# EAGLE schematic wiring (EAGLE 7.3.0)
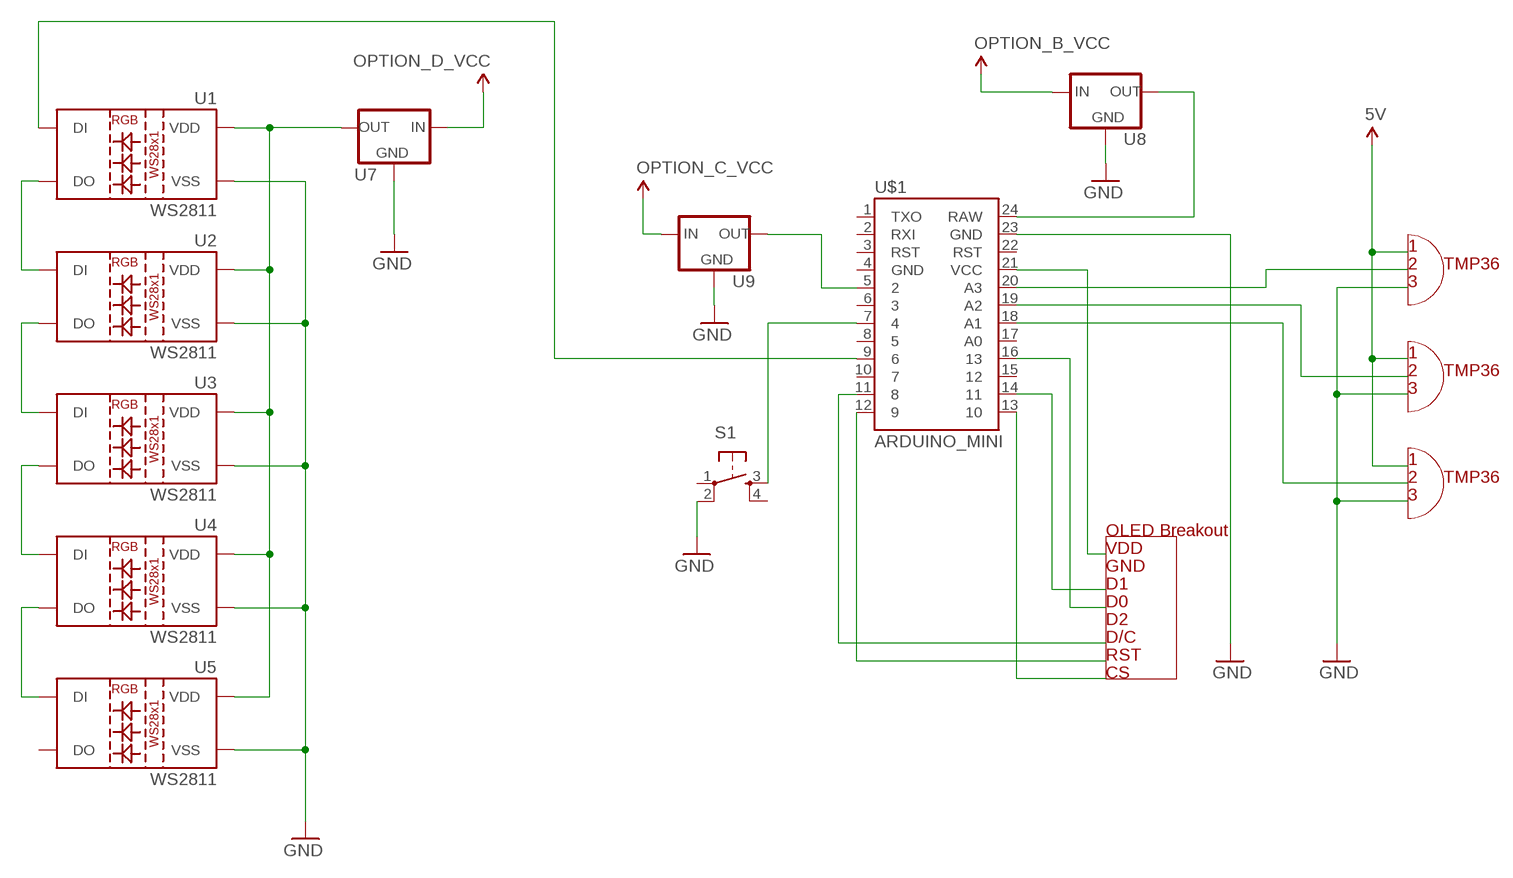
[diagram p0: schematic, sheet 1]

## Parts
S1  TAC_SWITCHPTH  [TACTILE-PTH]
U1  WS2811  LED-TRICOLOR-5050-ICWS2811  [LED-TRICOLOR-5050-IC]
U2  WS2811  LED-TRICOLOR-5050-ICWS2811  [LED-TRICOLOR-5050-IC]
U3  WS2811  LED-TRICOLOR-5050-ICWS2811  [LED-TRICOLOR-5050-IC]
U4  WS2811  LED-TRICOLOR-5050-ICWS2811  [LED-TRICOLOR-5050-IC]
U5  WS2811  LED-TRICOLOR-5050-ICWS2811  [LED-TRICOLOR-5050-IC]
U7  V_REG_78XXSIDE  [78XXL]
U8  V_REG_78XXSIDE  [78XXL]
U9  V_REG_78XXSIDE  [78XXL]
U$1  ARDUINO_MINI  [ARDUINO_MINI]

## Nets
GND: S1.2 U1.6(VSS) U2.6(VSS) U3.6(VSS) U4.6(VSS) U5.6(VSS) U7.GND U8.GND U9.GND U$1.23(GND)
N$1: U1.1(DO) U2.2(DI)
N$2: U1.2(DI) U$1.9
N$3: U2.1(DO) U3.2(DI)
N$4: U3.1(DO) U4.2(DI)
N$5: U4.1(DO) U5.2(DI)
N$6: U$1.20(A3)
N$7: U$1.19(A2)
N$8: U$1.18(A1)
N$9: U$1.16
N$10: U$1.21(VCC)
N$11: U$1.14
N$12: U$1.13
N$13: U$1.11
N$14: U$1.12
N$15: U9.OUT U$1.5
N$16: U8.OUT U$1.24(RAW)
N$17: U1.3(VDD) U1.5(VDD) U2.3(VDD) U2.5(VDD) U3.3(VDD) U3.5(VDD) U4.3(VDD) U4.5(VDD) U5.3(VDD) U5.5(VDD) U7.OUT
N$18: S1.3 U$1.7
VCC: U7.IN U8.IN U9.IN ; supply symbol labelled 5V, OPTION_D_VCC, OPTION_B_VCC, OPTION_C_VCC
Unconnected: S1.1 S1.4 U5.1(DO) U$1.1(TXO) U$1.2(RXI) U$1.3(RST) U$1.4(GND) U$1.6 U$1.8 U$1.10 U$1.15 U$1.17(A0) U$1.22(RST)

## Notes on the sheet
- 1
- 2 | TMP36
- 3
- 1
- 2 | TMP36
- 3
- 1
- 2 | TMP36
- 3
- OLED Breakout
- VDD
- GND
- D1
- D0
- D2
- D/C
- RST
- CS

## Library data of the parts
S1 = SparkFun-Retired:TAC_SWITCH: Momentary Switch Button commonly used for reset or general input. Spark Fun Electronics SKU : COM-00097 SMT- SWCH-08247
U1-U5 = SparkFun-LED:LED-TRICOLOR-5050-IC: WS2812 RGB LED w/ WS2811 driver 5x5mm SMD LED with built-in controller IC. DIO-11598; PROD_ID: DIO-11598
U7-U9 = SparkFun-PowerIC:V_REG_78XX: Voltage Regulator Standard 78xx regulator. IGO (Input Ground Output). Spark Fun Electronics SKU : COM-00107
U$1 = SparkFun-Boards:ARDUINO_MINI: Arduino Pro Mini footprint